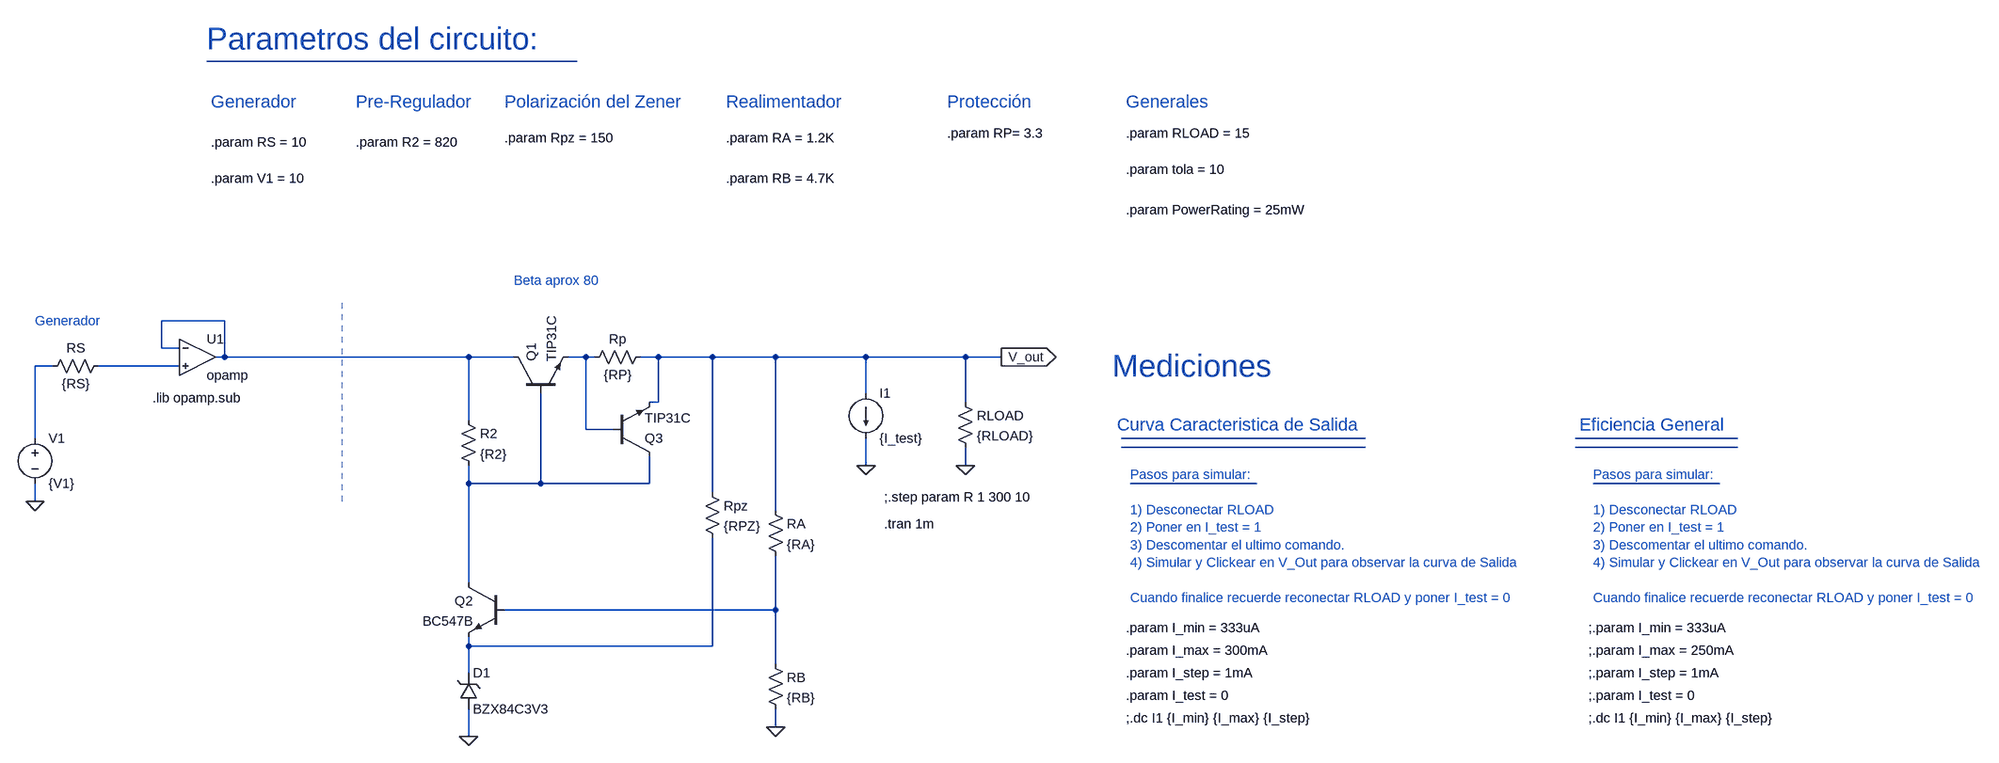
[diagram p0: schematic Fuente con Buffer.asc]
Fuente con Buffer.asc, the LTspice schematic file:
Version 4
SHEET 1 3316 680
WIRE 656 -592 0 -592
WIRE 32 -128 -80 -128
WIRE -80 -80 -80 -128
WIRE -48 -80 -80 -80
WIRE 32 -64 32 -128
WIRE 32 -64 16 -64
WIRE 464 -64 32 -64
WIRE 544 -64 464 -64
WIRE 672 -64 640 -64
WIRE 688 -64 672 -64
WIRE 800 -64 768 -64
WIRE 896 -64 800 -64
WIRE 1008 -64 896 -64
WIRE 1168 -64 1008 -64
WIRE 1344 -64 1168 -64
WIRE 1408 -64 1344 -64
WIRE -272 -48 -304 -48
WIRE -48 -48 -192 -48
WIRE 1168 0 1168 -64
WIRE 800 16 800 -64
WIRE 800 16 784 16
WIRE 1344 16 1344 -64
WIRE 464 48 464 -64
WIRE 672 64 672 -64
WIRE 720 64 672 64
WIRE -304 80 -304 -48
WIRE 2144 80 1712 80
WIRE 2832 80 2544 80
WIRE 2144 96 1712 96
WIRE 2832 96 2544 96
WIRE 1168 128 1168 80
WIRE 1344 128 1344 96
WIRE 464 160 464 128
WIRE 592 160 592 0
WIRE 592 160 464 160
WIRE 784 160 784 112
WIRE 784 160 592 160
WIRE 1952 160 1728 160
WIRE 2800 160 2576 160
WIRE 896 176 896 -64
WIRE -304 192 -304 160
WIRE 1008 208 1008 -64
WIRE 464 336 464 160
WIRE 1008 384 1008 288
WIRE 1008 384 528 384
WIRE 464 448 464 432
WIRE 896 448 896 256
WIRE 896 448 464 448
WIRE 1008 480 1008 384
WIRE 464 496 464 448
WIRE 1008 592 1008 560
WIRE 464 608 464 560
FLAG -304 192 0
FLAG 464 608 0
FLAG 1008 592 0
FLAG 1344 128 0
FLAG 1168 128 0
FLAG 1408 -64 V_out
IOPIN 1408 -64 Out
DATAFLAG 1104 -64 "I(Rload)"
DATAFLAG 1344 -64 ""
DATAFLAG 896 -64 ""
DATAFLAG 1008 384 ""
DATAFLAG 320 -64 ""
DATAFLAG 560 160 ""
SYMBOL voltage -304 64 R0
WINDOW 123 0 0 Left 0
WINDOW 39 0 0 Left 0
SYMATTR InstName V1
SYMATTR Value {V1}
SYMBOL res -176 -64 R90
WINDOW 0 0 56 VBottom 2
WINDOW 3 32 56 VTop 2
SYMATTR InstName RS
SYMATTR Value {RS}
SYMATTR SpiceLine tol={tola} pwr={PowerRating }
SYMBOL npn 544 0 R270
SYMATTR InstName Q1
SYMATTR Value TIP31C
SYMBOL npn 528 336 M0
SYMATTR InstName Q2
SYMATTR Value BC547B
SYMBOL zener 448 560 M180
WINDOW 0 24 64 Left 2
WINDOW 3 24 0 Left 2
SYMATTR InstName D1
SYMATTR Value BZX84C3V3
SYMBOL res 1328 0 R0
SYMATTR InstName RLOAD
SYMATTR Value {RLOAD}
SYMATTR SpiceLine tol=10
SYMBOL res 784 -80 R90
WINDOW 0 0 56 VBottom 2
WINDOW 3 32 56 VTop 2
SYMATTR InstName Rp
SYMATTR Value {RP}
SYMATTR SpiceLine tol={tola} pwr={PowerRating}
SYMBOL npn 720 112 M180
SYMATTR InstName Q3
SYMATTR Value TIP31C
SYMBOL res 992 192 R0
SYMATTR InstName RA
SYMATTR Value {RA}
SYMATTR SpiceLine tol=tola pwr={PowerRating}
SYMBOL res 992 464 R0
SYMATTR InstName RB
SYMATTR Value {RB}
SYMATTR SpiceLine tol={tola} pwr={PowerRating}
SYMBOL res 448 32 R0
SYMATTR InstName R2
SYMATTR Value {R2}
SYMATTR SpiceLine tol={tola} pwr={PowerRating}
SYMBOL res 880 160 R0
SYMATTR InstName Rpz
SYMATTR Value {RPZ}
SYMATTR SpiceLine tol={tola} pwr={PowerRating}
SYMBOL current 1168 0 R0
WINDOW 123 0 0 Left 0
WINDOW 39 0 0 Left 0
SYMATTR InstName I1
SYMATTR Value {I_test}
SYMBOL Opamps\\opamp -16 -128 R0
SYMATTR InstName U1
TEXT -304 -128 Left 2 ;Generador
TEXT 544 -200 Left 2 ;Beta aprox 80
TEXT 1200 184 Left 2 !;.step param R 1 300 10
TEXT 1720 576 Left 2 !;.dc I1 {I_min} {I_max} {I_step}
TEXT 1696 -48 Left 5 ;Mediciones
TEXT 1704 56 Left 3 ;Curva Caracteristica de Salida
TEXT 1720 416 Left 2 !.param I_min = 333uA
TEXT 1720 456 Left 2 !.param I_max = 300mA
TEXT 1720 496 Left 2 !.param I_step = 1mA
TEXT 1720 536 Left 2 !.param I_test = 0
TEXT 1728 144 Left 2 ;Pasos para simular:\n \n1) Desconectar RLOAD\n2) Poner en I_test = 1\n3) Descomentar el ultimo comando.\n4) Simular y Clickear en V_Out para observar la curva de Salida\n \nCuando finalice recuerde reconectar RLOAD y poner I_test = 0
TEXT 0 -632 Left 5 ;Parametros del circuito:
TEXT 8 -448 Left 2 !.param RS = 10
TEXT 8 -384 Left 2 !.param V1 = 10
TEXT 264 -448 Left 2 !.param R2 = 820
TEXT 8 -520 Left 3 ;Generador
TEXT 264 -520 Left 3 ;Pre-Regulador
TEXT 528 -520 Left 3 ;Polarización del Zener
TEXT 528 -456 Left 2 !.param Rpz = 150
TEXT 920 -520 Left 3 ;Realimentador
TEXT 920 -456 Left 2 !.param RA = 1.2K
TEXT 920 -384 Left 2 !.param RB = 4.7K
TEXT 1312 -464 Left 2 !.param RP= 3.3
TEXT 1200 232 Left 2 !.tran 1m
TEXT 1312 -520 Left 3 ;Protección
TEXT 2568 576 Left 2 !;.dc I1 {I_min} {I_max} {I_step}
TEXT 2552 56 Left 3 ;Eficiencia General
TEXT 2568 416 Left 2 !;.param I_min = 333uA
TEXT 2568 456 Left 2 !;.param I_max = 250mA
TEXT 2568 496 Left 2 !;.param I_step = 1mA
TEXT 2568 536 Left 2 !;.param I_test = 0
TEXT 2576 144 Left 2 ;Pasos para simular:\n \n1) Desconectar RLOAD\n2) Poner en I_test = 1\n3) Descomentar el ultimo comando.\n4) Simular y Clickear en V_Out para observar la curva de Salida\n \nCuando finalice recuerde reconectar RLOAD y poner I_test = 0
TEXT 1720 -400 Left 2 !.param tola = 10
TEXT 1720 -464 Left 2 !.param RLOAD = 15
TEXT 1720 -520 Left 3 ;Generales
TEXT 1720 -328 Left 2 !.param PowerRating = 25mW
TEXT -96 8 Left 2 !.lib opamp.sub
LINE Normal 240 192 240 -160 2

The netlist it stands for:
* Fuente con Buffer.asc
V1 N004 0 {V1}
RS N005 N004 {RS} tol={tola} pwr={PowerRating }
Q1 N002 N010 N003 0 TIP31C
Q2 N010 N013 N014 0 BC547B
D1 0 N014 BZX84C3V3
RLOAD V_out 0 {RLOAD} tol=10
Rp V_out N003 {RP} tol={tola} pwr={PowerRating}
Q3 N010 N003 V_out 0 TIP31C
RA V_out N013 {RA} tol=tola pwr={PowerRating}
RB N013 0 {RB} tol={tola} pwr={PowerRating}
R2 N002 N010 {R2} tol={tola} pwr={PowerRating}
Rpz V_out N014 {RPZ} tol={tola} pwr={PowerRating}
I1 V_out 0 {I_test}
XU1 N002 N005 N002 opamp Aol=100K GBW=10Meg  ; pins invin noninvin out
.model D D
.lib standard.dio
.model NPN NPN
.model PNP PNP
.lib standard.bjt
* Generador
* Beta aprox 80
;.step param R 1 300 10
;.dc I1 {I_min} {I_max} {I_step}
* Mediciones
* Curva Caracteristica de Salida
.param I_min = 333uA
.param I_max = 300mA
.param I_step = 1mA
.param I_test = 0
* Pasos para simular:
* 1) Desconectar RLOAD
* 2) Poner en I_test = 1
* 3) Descomentar el ultimo comando.
* 4) Simular y Clickear en V_Out para observar la curva de Salida
* Cuando finalice recuerde reconectar RLOAD y poner I_test = 0
* Parametros del circuito:
.param RS = 10
.param V1 = 10
.param R2 = 820
* Generador
* Pre-Regulador
* Polarización del Zener
.param Rpz = 150
* Realimentador
.param RA = 1.2K
.param RB = 4.7K
.param RP= 3.3
.tran 1m
* Protección
;.dc I1 {I_min} {I_max} {I_step}
* Eficiencia General
;.param I_min = 333uA
;.param I_max = 250mA
;.param I_step = 1mA
;.param I_test = 0
* Pasos para simular:
* 1) Desconectar RLOAD
* 2) Poner en I_test = 1
* 3) Descomentar el ultimo comando.
* 4) Simular y Clickear en V_Out para observar la curva de Salida
* Cuando finalice recuerde reconectar RLOAD y poner I_test = 0
.param tola = 10
.param RLOAD = 15
* Generales
.param PowerRating = 25mW
.lib opamp.sub
.backanno
.end